# EAGLE design gate_wifi__bottom (EAGLE 9.6.2)
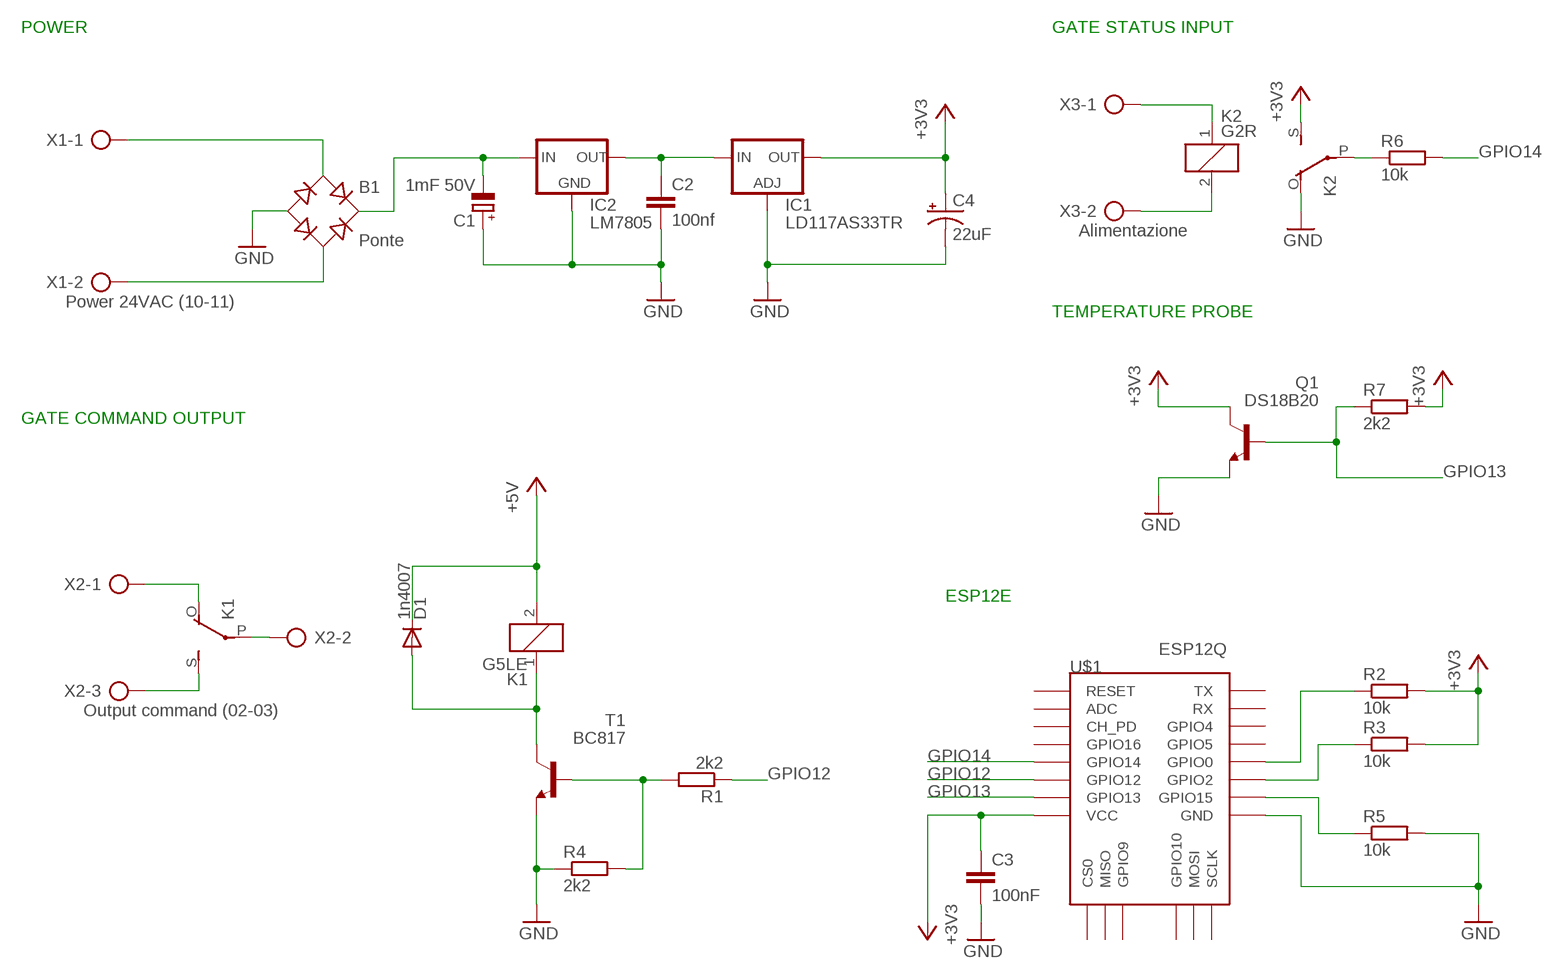
[diagram p0: schematic, sheet 1]

## Parts
B1  Ponte  RB1A_MODMOD  [RB1A_MOD]
C1  1mF 50V  CPOL-EUE5-8.5  [E5-8,5]
C2  100nf  C-EUC0805K  [C0805K]
C3  100nF  C-EUC0805K  [C0805K]
C4  22uF  CPOL-USE2.5-5  [E2,5-5]
D1  1n4007  DIODE-DO-214AC  [DO-214AC]
IC1  LD117AS33TR  [SOT223]
IC2  LM7805  78XXS  [78XXS]
K1  G5LE  [G5LE]
K2  G2R  [G2R]
Q1  DS18B20  2N3565  [TO92]
R1  2k2  R-EU_M0805  [M0805]
R2  10k  R-EU_M0805  [M0805]
R3  10k  R-EU_M0805  [M0805]
R4  2k2  R-EU_M0805  [M0805]
R5  10k  R-EU_M0805  [M0805]
R6  10k  R-EU_M0805  [M0805]
R7  2k2  R-EU_M0805  [M0805]
T1  BC817  BC817-16LT1-NPN-SOT23-BEC  [SOT23-BEC]
U$1  ESP12Q  [ESP12Q]
X1  Power 24VAC (10-11)  AK500/2  [AK500/2]
X2  Output command (02-03)  AK500/3  [AK500/3]
X3  Alimentazione  AK500/2  [AK500/2]

## Nets
+3V3 [230vac]: C3.1 C4.+ IC1.4(OUT) K2.S(2:S) Q1.1(C) R2.2 R3.2 R7.2 U$1.VCC
+5V [230vac]: D1.C K1.2
GND [230vac]: B1.- C1.+ C2.2 C3.2 C4.- IC1.1(ADJ) IC2.GND K2.O(2:O) Q1.3(E) R4.1 R5.2 T1.E U$1.GND
GPIO12 [230vac]: R1.1 U$1.GPIO12
GPIO13 [230vac]: Q1.2(B) R7.1 U$1.GPIO13
GPIO14 [230vac]: R6.2 U$1.GPIO14
N$2 [230vac]: B1.AC1 X1.1
N$3 [230vac]: B1.AC2 X1.2
N$4 [230vac]: K1.P(2:P) X2.2
N$5 [230vac]: K1.S(2:S) X2.3
N$6 [230vac]: K1.O(2:O) X2.1
N$7 [230vac]: D1.A K1.1 T1.C
N$11 [230vac]: R5.1 U$1.GPIO15
N$12 [230vac]: R1.2 R4.2 T1.B
N$14 [230vac]: B1.+ C1.- IC2.IN
N$15 [230vac]: K2.1 X3.1
N$16 [230vac]: C2.1 IC1.3(IN) IC2.OUT
N$18 [230vac]: K2.2 X3.2
N$19 [230vac]: R3.1 U$1.GPIO2
N$20 [230vac]: R2.1 U$1.GPIO0
N$24 [230vac]: K2.P(2:P) R6.1
Unconnected: U$1.ADC U$1.CH_PD U$1.CS0 U$1.GPIO4 U$1.GPIO5 U$1.GPIO9 U$1.GPIO10 U$1.GPIO16 U$1.MISO U$1.MOSI U$1.RESET U$1.RX U$1.SCLK U$1.TX

## Notes on the sheet
- POWER | GATE STATUS INPUT
- TEMPERATURE PROBE
- GATE COMMAND OUTPUT
- ESP12E

## Library data of the parts
B1 = rectifier_mod:RB1A_MOD: RECTIFIER 1 A
C1 = rcl:CPOL-EU: POLARIZED CAPACITOR, European symbol
C2 C3 = rcl:C-EU: CAPACITOR, European symbol
C4 = rcl:CPOL-US: POLARIZED CAPACITOR, American symbol
D1 = diode:DIODE-: DIODE
IC1 = v-reg:LD117A?*: Low drop fixed and adjustable positive voltage regulators 1 A Source: http://www.st.com/stonline/products/literature/ds/7194/ld1117axx.pdf
IC2 = v-reg:78XXS: VOLTAGE REGULATOR
K1 = relay:G5LE: RELAY 1 x switch, 10 A/120 V AC, 8 A/30 V DC, Omron; OC_FARNELL: unknown; OC_NEWARK: unknown
K2 = relay:G2R: RELAY 1 x switch, Omron; OC_FARNELL: 1569185; OC_NEWARK: unknown
Q1 = transistor-npn_mod:2N3565: NPN Transistor
R1-R7 = rcl:R-EU_: RESISTOR, European symbol
T1 = transistor:*-NPN-: NPN Transistror BF959 corrected 2008.03.06
U$1 = esp826612q:ESP12Q: ESP8266 Wifi module 12-Q
X1 X3 = con-ptr500:AK500/2: CONNECTOR; OC_FARNELL: unknown; OC_NEWARK: unknown
X2 = con-ptr500:AK500/3: CONNECTOR; OC_FARNELL: unknown; OC_NEWARK: unknown

## Net classes
1 230vac: width 0.762 mm
2 5vdc: width 0.508 mm

## Board
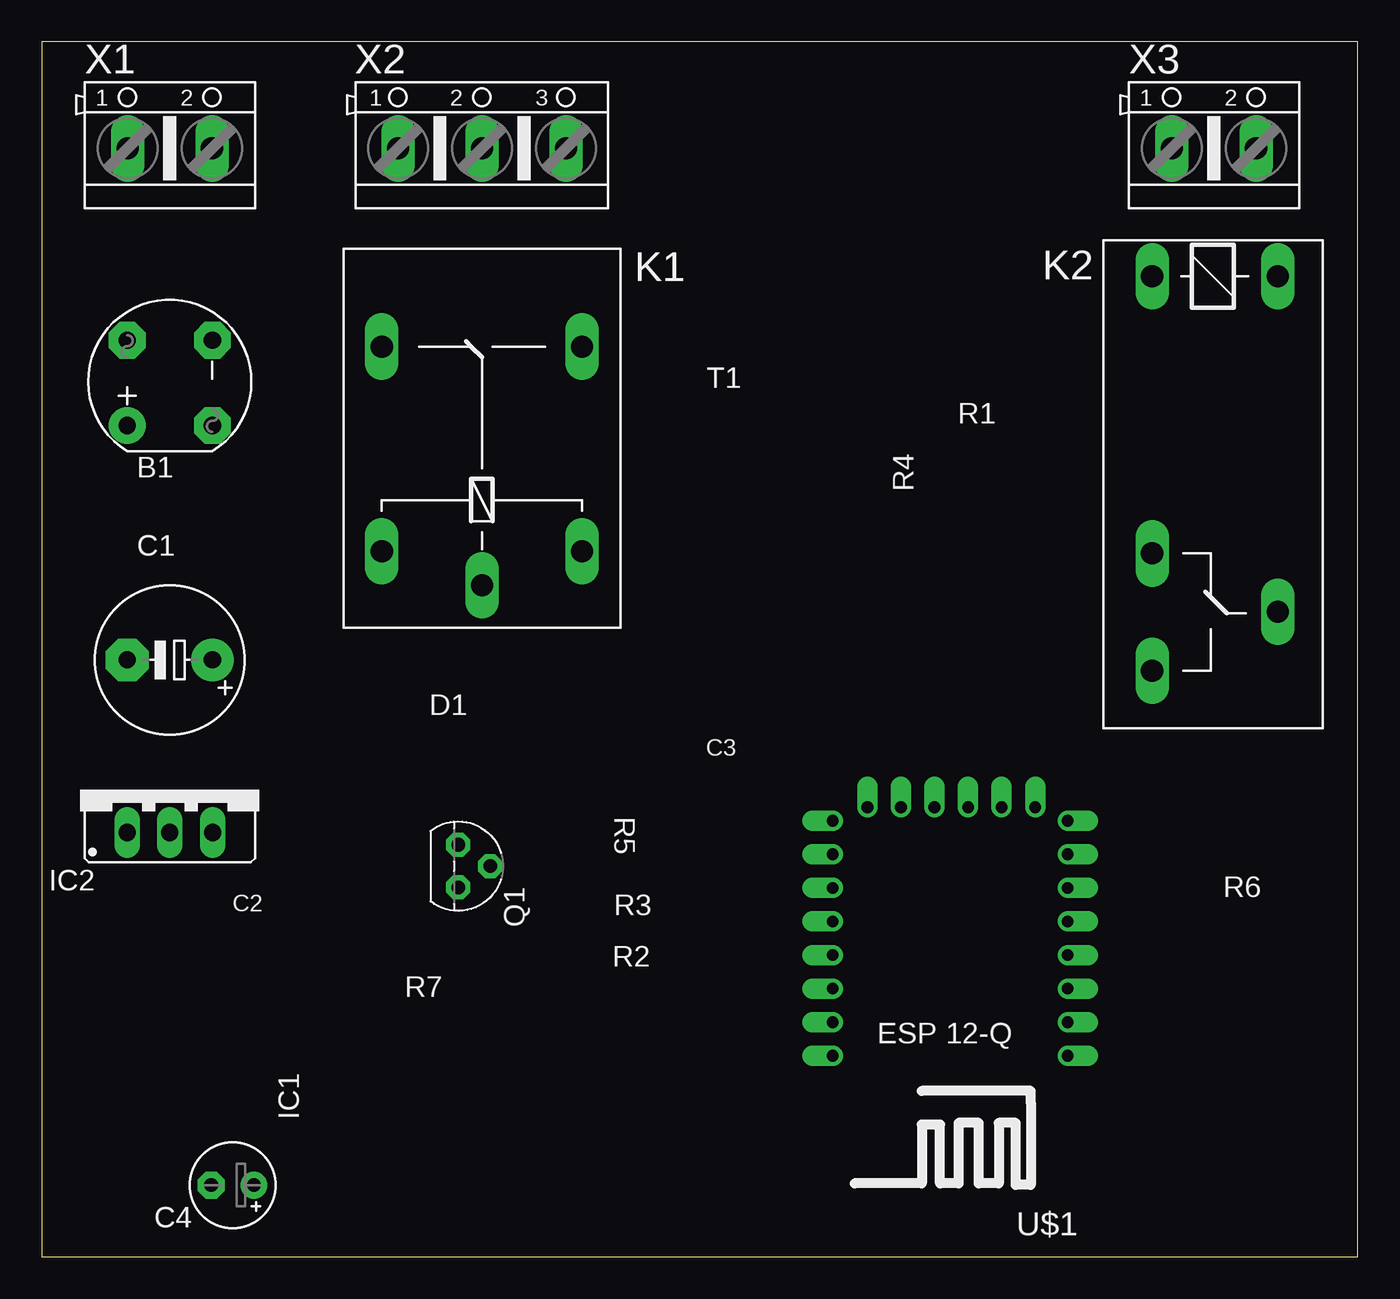
[diagram p1: board, top side]
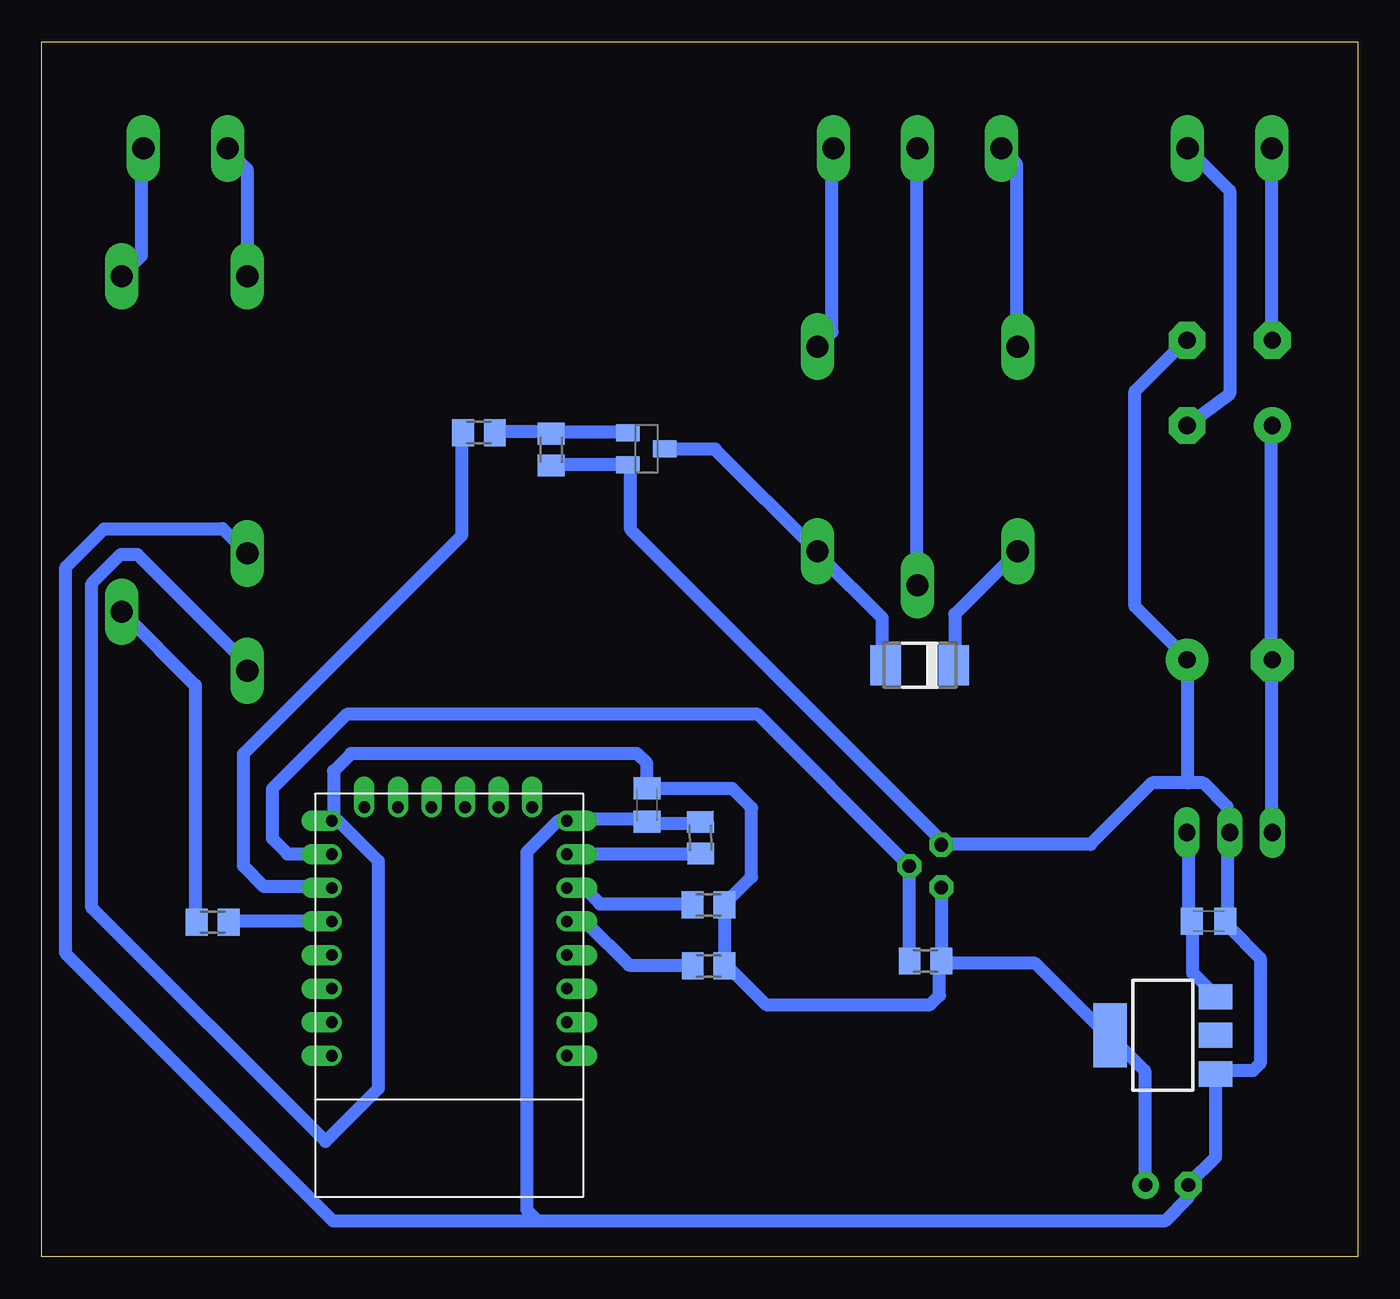
[diagram p2: board, bottom side, seen from below]

Size 78.41 x 72.38 mm. Coordinates in mm from the lower left corner, seen from the top.
Outline: 0,0 78.41,0 78.41,72.38 0,72.38 0,0
Copper layers (1*16): Top 0.035mm / dielectric 1.5mm / Bottom 0.035mm
Design rules "default *": minimum track width 6mil, minimum drill 0.35mm, track to track 12mil, track to pad 12mil, pad to pad 12mil, via to via 12mil, smd to smd 12mil, copper to edge 40mil, drill to drill 6mil, minimum pad ring 10mil, minimum via ring 8mil, stop-mask expansion 4mil, vias tented up to drill 0mil, thermal gap 10mil

### Footprints (pad centres in the part's own frame; a part is rotated, then mirrored left to right if it is on the bottom)
RB1A_MOD = drill 1.016 pad 2.184: + -2.54,2.54 | drill 1.016 pad 2.184 octagon: - 2.54,-2.54; AC1 2.54,2.54; AC2 -2.54,-2.54
E5-8,5 = drill 1.016 pad 2.54: + -2.54,0 | drill 1.016 pad 2.54 octagon: - 2.54,0
C0805K = smd 1.3 x 1.6: 1 -1,0; 2 1,0
E2,5-5 = drill 0.813 pad 1.6: + -1.27,0 | drill 0.813 pad 1.6 octagon: - 1.27,0
DO-214AC = smd 1.8 x 2.4: A 2.025,0; C -2.025,0
SOT223 = smd 1.5 x 2: 1 -2.3,-3.15; 2 0,-3.15; 3 2.3,-3.15 | smd 3.8 x 2: 4 0,3.15
78XXS = drill 1.016 long: GND 0,-2.54; IN -2.54,-2.54; OUT 2.54,-2.54
G5LE = drill 1.321 long: 1 -7.493,-5.969; 2 -7.493,5.969; O 4.699,5.969; P -9.525,0; S 4.699,-5.969
G2R = drill 1.321 long: 1 -2.54,-3.683; 2 -2.54,3.81; O 13.97,-3.683; P 17.45,3.81; S 20.955,-3.683
TO92 = drill 0.813 pad 1.422 octagon: 1 1.27,0; 2 0,1.905; 3 -1.27,0
M0805 = smd 1.3 x 1.6: 1 -0.95,0; 2 0.95,0
SOT23-BEC = smd 1 x 1.4: B -0.95,-1.1; C 0,1.1; E 0.95,-1.1
ESP12Q = drill 0.7 offset: ADC -7.1,3.8; CH_PD -7.1,1.8; CS0 -5.165,-9.005; GND 6.9,-8.2; GPIO0 6.9,-2.2; GPIO2 6.9,-4.2; GPIO4 6.9,1.8; GPIO5 6.9,-0.2; GPIO9 -1.165,-9.005; GPIO10 0.835,-9.005; GPIO12 -7.1,-4.2; GPIO13 -7.1,-6.2; GPIO14 -7.1,-2.2; GPIO15 6.9,-6.2; GPIO16 -7.1,-0.2; MISO -3.165,-9.005; MOSI 2.835,-9.005; RESET -7.1,5.8; RX 6.9,3.8; SCLK 4.835,-9.005; TX 6.9,5.8; VCC -7.1,-8.2
AK500/2 = drill 1.321 long: 1 -2.515,0; 2 2.515,0
AK500/3 = drill 1.321 long: 1 -5.004,0; 2 0,0; 3 5.004,0

### Placement (x,y rotation side)
B1  7.62,52.07 90 top
C1  7.62,35.56 180 top
C2  8.88,20 0 bottom
C3  42.35,26.92 270 bottom
C4  11.36,4.27 180 top
D1  26.09,35.24 180 bottom
IC1  11.61,13.2 90 bottom
IC2  7.63,27.82 0 top
K1  26.23,49.53 90 top
K2  69.85,55.88 270 top
Q1  24.81,23.28 270 top
R1  52.37,49.1 0 bottom
R2  38.67,17.34 0 bottom
R3  38.68,20.97 0 bottom
R4  48.06,48.09 90 bottom
R5  39.16,24.97 90.6 bottom
R6  68.24,19.93 0 bottom
R7  25.74,17.62 0 bottom
T1  42.38,48.15 270 bottom
U$1  54.03,17.78 180 top
X1  7.62,66.04 0 top
X2  26.23,66.04 0 top
X3  69.85,66.04 0 top

### Tracks (layer width: path | path; a pad name or v marks a point on that pad's centre or on a via)
+3V3
  Bottom 0.762: R7.2 24.8,17.72 24.8,21.95 Q1.1 | C4.+ 12.69,4.34 12.69,11.09 14.74,13.14 IC1.4 15.09,13.37 19.2,17.49 24.46,17.49 R7.2 | K2.S 66.17,35.3 72.72,41.85 73.7,41.85 75.44,40.12 75.44,20.8 61.52,6.87 58.37,10.02 58.37,23.58 60.77,25.98 U$1.VCC 61.04,26.06 61.04,28.94 59.99,29.98 42.95,29.98 42.35,29.39 C3.1 42.29,27.89 37.26,27.89 36.12,26.75 36.12,22.63 37.49,21.26 R3.2 37.72,20.92 37.72,17.37 R2.2 37.38,17.14 35.26,15.02 25.48,15.02 24.92,15.58 24.92,17.26 R7.2
+5V
  Bottom 0.762: K1.2 24,38.29 24,35.32 D1.C
GND
  Bottom 0.762: R5.2 39.16,25.83 42.29,25.83 C3.2 42.63,26.06 47.09,26.06 U$1.GND 47.64,25.98 49.52,24.1 49.52,2.81 48.84,2.13 | K2.O 67.64,43.38 67.69,43.37 74.71,43.37 76.99,41.09 76.99,18.06 61.05,2.13 48.84,2.13 | B1.- 10.22,54.61 13.26,51.58 13.26,38.75 10.17,35.66 C1.+ 10.13,35.53 10.13,28.25 | R4.1 48.01,47.21 43.55,47.21 T1.E 43.32,46.86 43.32,43.32 24.92,24.92 Q1.3 24.8,24.57 15.92,24.57 12.25,28.25 10.13,28.25 | 10.13,28.25 9.2,28.25 7.78,26.83 IC2.GND 7.66,25.26 7.77,25.15 7.77,20 C2.2 7.66,19.66 5.8,17.8 5.8,11.53 6.24,11.09 8.12,11.09 IC1.1 8.46,10.86 8.46,5.94 10.06,4.34 C4.- 10.09,3.54 11.5,2.13 48.84,2.13
GPIO12
  Bottom 0.762: R1.1 53.38,49.03 53.38,43 66.4,29.97 66.4,23.27 65.19,22.06 61.15,22.06 U$1.GPIO12
GPIO13
  Bottom 0.762: R7.1 26.75,17.72 26.75,23.2 Q1.2 26.98,23.55 35.74,32.31 60.25,32.31 64.69,27.88 64.69,24.92 63.77,24 61.15,24 U$1.GPIO13
GPIO14
  Bottom 0.762: R6.2 67.21,20 61.15,20 U$1.GPIO14
N$2
  Bottom 0.762: B1.AC1 5.14,54.63 5.14,65.95 X1.1
N$3
  Bottom 0.762: B1.AC2 7.63,51.43 7.63,63.52 10.06,65.95 X1.2
N$4
  Bottom 0.762: K1.P 26.29,40.01 26.29,65.95 X2.2
N$5
  Bottom 0.762: X2.3 31.32,65.95 31.32,55.09 32.12,54.29 K1.S
N$6
  Bottom 0.762: K1.O 20.34,54.29 20.34,65.15 21.14,65.95 X2.1
N$7
  Bottom 0.762: T1.C 41.26,48.12 38.29,48.12 32.23,42.06 K1.1 32,41.72 28.35,38.06 28.35,35.89 D1.A
  Bottom 1.27: 28.18,35.29 D1.A
N$11
  Bottom 0.762: R5.1 39.2,24 47.09,24 U$1.GPIO15
N$12
  Bottom 0.762: T1.B 43.55,49.15 48.01,49.15 R4.2 48.35,49.15 51.32,49.15 R1.2
N$14
  Bottom 0.762: B1.+ 5.14,49.49 5.14,35.66 C1.- 5.14,35.2 5.14,25.38 IC2.IN
N$15
  Bottom 0.762: K2.1 66.18,58.52 66.18,64.81 67.32,65.95 X3.1
N$16
  Bottom 0.762: IC1.3 8.46,15.54 9.83,16.92 9.83,20 C2.1 10.06,20.34 10.06,25.26 IC2.OUT
N$18
  Bottom 0.762: X3.2 72.47,65.95 72.47,59.66 73.61,58.52 K2.2
N$19
  Bottom 0.762: R3.1 39.66,21.03 45.15,21.03 46.06,21.95 47.09,21.95 U$1.GPIO2
N$20
  Bottom 0.762: R2.1 39.66,17.37 43.43,17.37 45.95,19.89 47.09,19.89 U$1.GPIO0
N$24
  Bottom 0.762: R6.1 69.27,20 69.27,34.06 73.61,38.41 K2.P